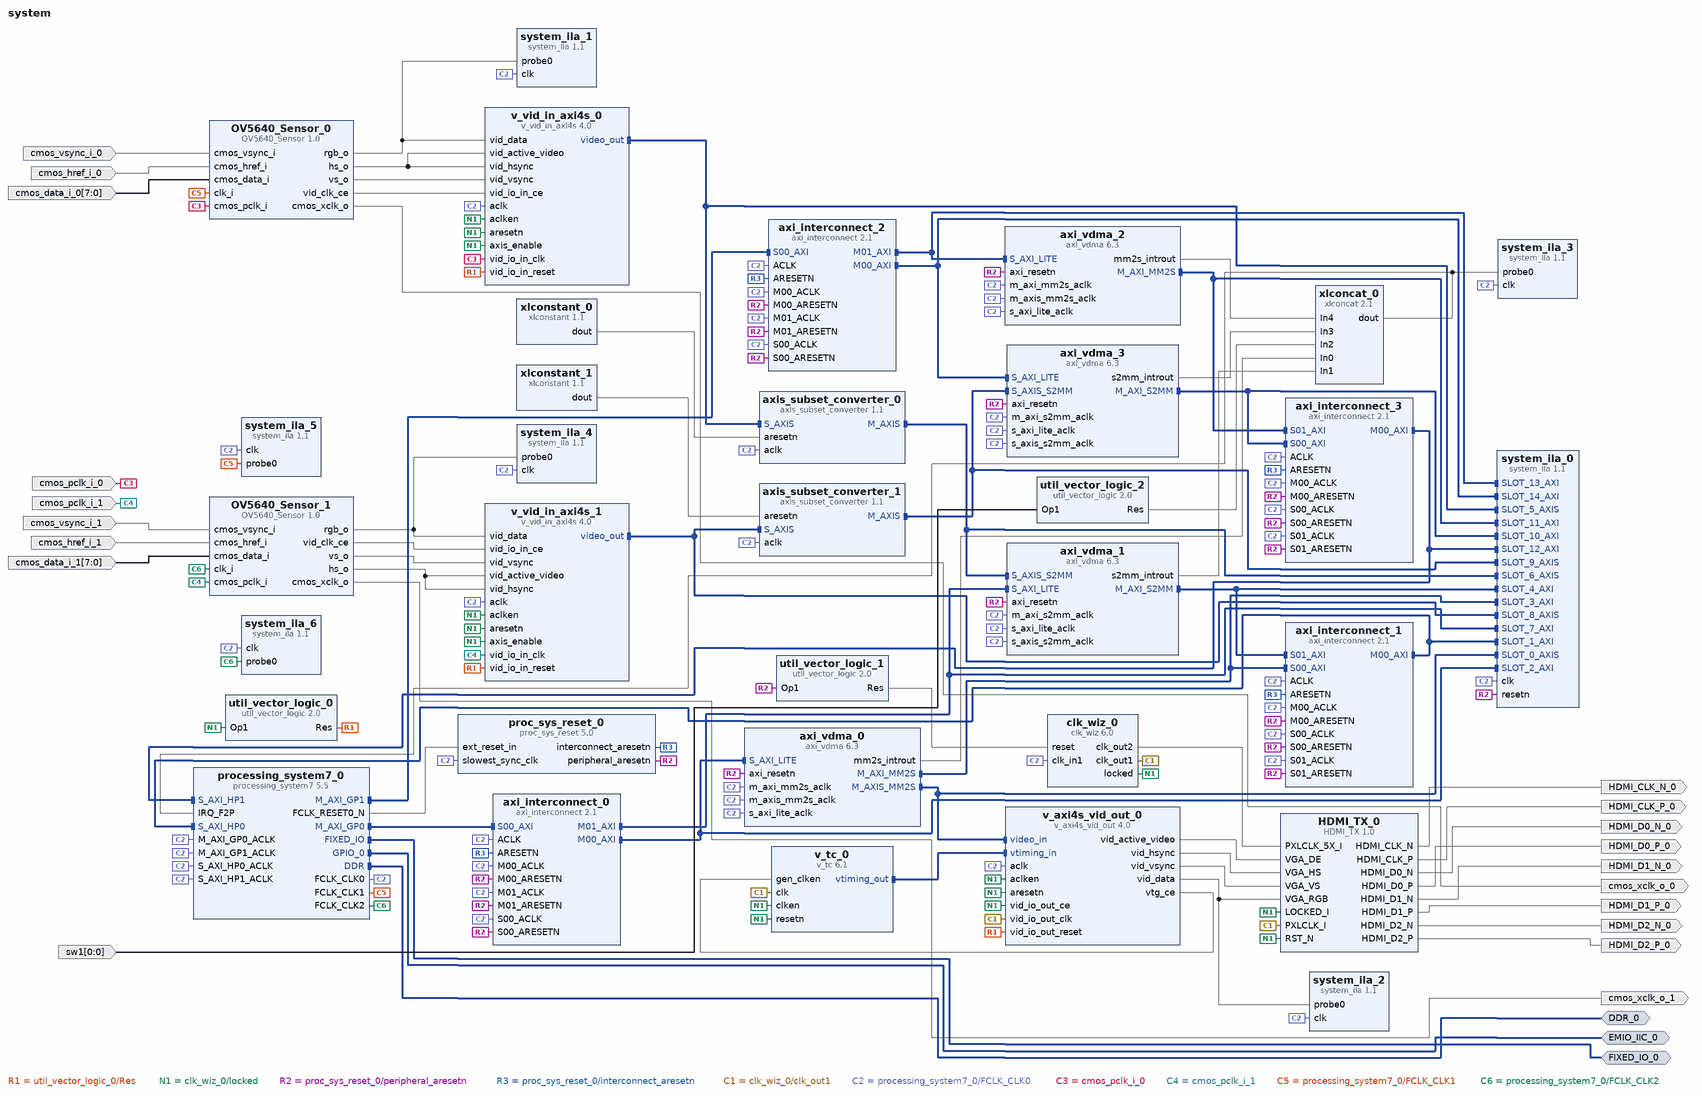
[diagram p0: block diagram of the top level]
# Vivado block design system, xc7z020clg400-2, Vivado 2018.3
create_bd_design system

create_bd_intf_port -mode Master -vlnv xilinx.com:interface:ddrx_rtl:1.0 DDR_0
create_bd_intf_port -mode Master -vlnv xilinx.com:display_processing_system7:fixedio_rtl:1.0 FIXED_IO_0
create_bd_intf_port -mode Master -vlnv xilinx.com:interface:gpio_rtl:1.0 EMIO_IIC_0
create_bd_port -dir O -type clk HDMI_CLK_P_0
create_bd_port -dir O -type clk HDMI_CLK_N_0
create_bd_port -dir O HDMI_D2_P_0
create_bd_port -dir O HDMI_D2_N_0
create_bd_port -dir O HDMI_D1_P_0
create_bd_port -dir O HDMI_D1_N_0
create_bd_port -dir O HDMI_D0_P_0
create_bd_port -dir O HDMI_D0_N_0
create_bd_port -dir I cmos_vsync_i_0
create_bd_port -dir I cmos_href_i_0
create_bd_port -dir I -from 7 -to 0 cmos_data_i_0
create_bd_port -dir O cmos_xclk_o_0
create_bd_port -dir I cmos_pclk_i_0
create_bd_port -dir I -from 0 -to 0 sw1
create_bd_port -dir I cmos_pclk_i_1
create_bd_port -dir I cmos_vsync_i_1
create_bd_port -dir I cmos_href_i_1
create_bd_port -dir I -from 7 -to 0 cmos_data_i_1
create_bd_port -dir O cmos_xclk_o_1

create_bd_cell -type ip -vlnv xilinx.com:user:HDMI_TX:1.0 HDMI_TX_0
create_bd_cell -type ip -vlnv xilinx.com:user:OV5640_Sensor:1.0 OV5640_Sensor_0
create_bd_cell -type ip -vlnv xilinx.com:ip:processing_system7:5.5 processing_system7_0
set_property -dict [list \
  CONFIG.PCW_CRYSTAL_PERIPHERAL_FREQMHZ 50 \
  CONFIG.PCW_ENET0_PERIPHERAL_ENABLE 0 \
  CONFIG.PCW_EN_CLK1_PORT 1 \
  CONFIG.PCW_EN_CLK2_PORT 1 \
  CONFIG.PCW_FCLK_CLK1_BUF TRUE \
  CONFIG.PCW_FCLK_CLK2_BUF TRUE \
  CONFIG.PCW_FPGA0_PERIPHERAL_FREQMHZ 100 \
  CONFIG.PCW_FPGA1_PERIPHERAL_FREQMHZ 25 \
  CONFIG.PCW_FPGA2_PERIPHERAL_FREQMHZ 25 \
  CONFIG.PCW_FPGA_FCLK1_ENABLE 1 \
  CONFIG.PCW_FPGA_FCLK2_ENABLE 1 \
  CONFIG.PCW_GPIO_EMIO_GPIO_ENABLE 1 \
  CONFIG.PCW_GPIO_EMIO_GPIO_IO 4 \
  CONFIG.PCW_GPIO_EMIO_GPIO_WIDTH 4 \
  CONFIG.PCW_GPIO_MIO_GPIO_ENABLE 1 \
  CONFIG.PCW_GPIO_MIO_GPIO_IO MIO \
  CONFIG.PCW_I2C_RESET_ENABLE 1 \
  CONFIG.PCW_IRQ_F2P_INTR 1 \
  CONFIG.PCW_P2F_GPIO_INTR 1 \
  CONFIG.PCW_PRESET_BANK1_VOLTAGE {LVCMOS 1.8V} \
  CONFIG.PCW_QSPI_GRP_FBCLK_ENABLE 1 \
  CONFIG.PCW_QSPI_GRP_FBCLK_IO {MIO 8} \
  CONFIG.PCW_QSPI_GRP_SINGLE_SS_ENABLE 1 \
  CONFIG.PCW_QSPI_GRP_SINGLE_SS_IO {MIO 1 .. 6} \
  CONFIG.PCW_QSPI_PERIPHERAL_ENABLE 1 \
  CONFIG.PCW_QSPI_QSPI_IO {MIO 1 .. 6} \
  CONFIG.PCW_SD0_GRP_CD_ENABLE 1 \
  CONFIG.PCW_SD0_GRP_CD_IO {MIO 47} \
  CONFIG.PCW_SD0_GRP_WP_ENABLE 0 \
  CONFIG.PCW_SD0_PERIPHERAL_ENABLE 1 \
  CONFIG.PCW_SD0_SD0_IO {MIO 40 .. 45} \
  CONFIG.PCW_SDIO_PERIPHERAL_FREQMHZ 100 \
  CONFIG.PCW_SINGLE_QSPI_DATA_MODE x4 \
  CONFIG.PCW_UART1_PERIPHERAL_ENABLE 1 \
  CONFIG.PCW_UART1_UART1_IO {MIO 48 .. 49} \
  CONFIG.PCW_UART_PERIPHERAL_FREQMHZ 100 \
  CONFIG.PCW_UIPARAM_DDR_PARTNO {MT41K256M16 RE-125} \
  CONFIG.PCW_USB0_PERIPHERAL_ENABLE 0 \
  CONFIG.PCW_USB_RESET_ENABLE 1 \
  CONFIG.PCW_USE_FABRIC_INTERRUPT 1 \
  CONFIG.PCW_USE_M_AXI_GP1 1 \
  CONFIG.PCW_USE_S_AXI_HP0 1 \
  CONFIG.PCW_USE_S_AXI_HP1 1 \
] [get_bd_cells processing_system7_0]
# 216 more settings of processing_system7_0 are not shown: defaults, MIO pin electricals, DDR timing, and values the tool derives
create_bd_cell -type ip -vlnv xilinx.com:ip:v_vid_in_axi4s:4.0 v_vid_in_axi4s_0
set_property -dict {CONFIG.C_HAS_ASYNC_CLK 1} [get_bd_cells v_vid_in_axi4s_0]
create_bd_cell -type ip -vlnv xilinx.com:ip:v_axi4s_vid_out:4.0 v_axi4s_vid_out_0
set_property -dict {CONFIG.C_HAS_ASYNC_CLK 1} [get_bd_cells v_axi4s_vid_out_0]
create_bd_cell -type ip -vlnv xilinx.com:ip:clk_wiz:6.0 clk_wiz_0
set_property -dict [list \
  CONFIG.CLKOUT1_JITTER 337.616 \
  CONFIG.CLKOUT1_PHASE_ERROR 322.999 \
  CONFIG.CLKOUT1_REQUESTED_OUT_FREQ 74.25 \
  CONFIG.CLKOUT2_JITTER 258.703 \
  CONFIG.CLKOUT2_PHASE_ERROR 322.999 \
  CONFIG.CLKOUT2_REQUESTED_OUT_FREQ 371.25 \
  CONFIG.CLKOUT2_USED true \
  CONFIG.MMCM_CLKFBOUT_MULT_F 37.125 \
  CONFIG.MMCM_CLKOUT0_DIVIDE_F 10.000 \
  CONFIG.MMCM_CLKOUT1_DIVIDE 2 \
  CONFIG.MMCM_DIVCLK_DIVIDE 5 \
  CONFIG.NUM_OUT_CLKS 2 \
] [get_bd_cells clk_wiz_0]
create_bd_cell -type ip -vlnv xilinx.com:ip:util_vector_logic:2.0 util_vector_logic_0
set_property -dict {CONFIG.C_OPERATION not CONFIG.C_SIZE 1} [get_bd_cells util_vector_logic_0]
create_bd_cell -type ip -vlnv xilinx.com:ip:axi_vdma:6.3 axi_vdma_0
set_property -dict [list \
  CONFIG.c_include_mm2s_dre 1 \
  CONFIG.c_include_s2mm 0 \
  CONFIG.c_m_axis_mm2s_tdata_width 24 \
  CONFIG.c_mm2s_genlock_mode 0 \
  CONFIG.c_mm2s_max_burst_length 128 \
] [get_bd_cells axi_vdma_0]
create_bd_cell -type ip -vlnv xilinx.com:ip:xlconstant:1.1 xlconstant_0
set_property -dict {CONFIG.CONST_VAL 1 CONFIG.CONST_WIDTH 1} [get_bd_cells xlconstant_0]
create_bd_cell -type ip -vlnv xilinx.com:ip:axi_interconnect:2.1 axi_interconnect_0
set_property -dict {CONFIG.NUM_MI 2} [get_bd_cells axi_interconnect_0]
create_bd_cell -type ip -vlnv xilinx.com:ip:proc_sys_reset:5.0 proc_sys_reset_0
create_bd_cell -type ip -vlnv xilinx.com:ip:axi_interconnect:2.1 axi_interconnect_1
set_property -dict {CONFIG.NUM_MI 1 CONFIG.NUM_SI 2} [get_bd_cells axi_interconnect_1]
create_bd_cell -type ip -vlnv xilinx.com:ip:v_tc:6.1 v_tc_0
set_property -dict {CONFIG.HAS_AXI4_LITE false CONFIG.enable_detection false} [get_bd_cells v_tc_0]
create_bd_cell -type ip -vlnv xilinx.com:ip:util_vector_logic:2.0 util_vector_logic_1
set_property -dict {CONFIG.C_OPERATION not CONFIG.C_SIZE 1} [get_bd_cells util_vector_logic_1]
create_bd_cell -type ip -vlnv xilinx.com:ip:axis_subset_converter:1.1 axis_subset_converter_0
create_bd_cell -type ip -vlnv xilinx.com:ip:axi_vdma:6.3 axi_vdma_1
set_property -dict [list \
  CONFIG.c_include_mm2s 0 \
  CONFIG.c_include_s2mm_dre 1 \
  CONFIG.c_s2mm_genlock_mode 0 \
  CONFIG.c_s2mm_linebuffer_depth 4096 \
  CONFIG.c_s2mm_max_burst_length 128 \
] [get_bd_cells axi_vdma_1]
create_bd_cell -type ip -vlnv xilinx.com:ip:xlconcat:2.1 xlconcat_0
set_property -dict {CONFIG.NUM_PORTS 5} [get_bd_cells xlconcat_0]
create_bd_cell -type ip -vlnv xilinx.com:ip:system_ila:1.1 system_ila_0
set_property -dict [list \
  CONFIG.C_DATA_DEPTH 1024 \
  CONFIG.C_MON_TYPE INTERFACE \
  CONFIG.C_NUM_MONITOR_SLOTS 15 \
  CONFIG.C_SLOT_0_APC_EN 0 \
  CONFIG.C_SLOT_0_AXI_DATA_SEL 1 \
  CONFIG.C_SLOT_0_AXI_TRIG_SEL 1 \
  CONFIG.C_SLOT_0_INTF_TYPE xilinx.com:interface:axis_rtl:1.0 \
  CONFIG.C_SLOT_10_APC_EN 0 \
  CONFIG.C_SLOT_10_AXI_AR_SEL_DATA 1 \
  CONFIG.C_SLOT_10_AXI_AR_SEL_TRIG 1 \
  CONFIG.C_SLOT_10_AXI_AW_SEL_DATA 1 \
  CONFIG.C_SLOT_10_AXI_AW_SEL_TRIG 1 \
  CONFIG.C_SLOT_10_AXI_B_SEL_DATA 1 \
  CONFIG.C_SLOT_10_AXI_B_SEL_TRIG 1 \
  CONFIG.C_SLOT_10_AXI_R_SEL_DATA 1 \
  CONFIG.C_SLOT_10_AXI_R_SEL_TRIG 1 \
  CONFIG.C_SLOT_10_AXI_W_SEL_DATA 1 \
  CONFIG.C_SLOT_10_AXI_W_SEL_TRIG 1 \
  CONFIG.C_SLOT_10_INTF_TYPE xilinx.com:interface:aximm_rtl:1.0 \
  CONFIG.C_SLOT_11_APC_EN 0 \
  CONFIG.C_SLOT_11_AXI_AR_SEL_DATA 1 \
  CONFIG.C_SLOT_11_AXI_AR_SEL_TRIG 1 \
  CONFIG.C_SLOT_11_AXI_AW_SEL_DATA 1 \
  CONFIG.C_SLOT_11_AXI_AW_SEL_TRIG 1 \
  CONFIG.C_SLOT_11_AXI_B_SEL_DATA 1 \
  CONFIG.C_SLOT_11_AXI_B_SEL_TRIG 1 \
  CONFIG.C_SLOT_11_AXI_R_SEL_DATA 1 \
  CONFIG.C_SLOT_11_AXI_R_SEL_TRIG 1 \
  CONFIG.C_SLOT_11_AXI_W_SEL_DATA 1 \
  CONFIG.C_SLOT_11_AXI_W_SEL_TRIG 1 \
  CONFIG.C_SLOT_11_INTF_TYPE xilinx.com:interface:aximm_rtl:1.0 \
  CONFIG.C_SLOT_12_APC_EN 0 \
  CONFIG.C_SLOT_12_AXI_AR_SEL_DATA 1 \
  CONFIG.C_SLOT_12_AXI_AR_SEL_TRIG 1 \
  CONFIG.C_SLOT_12_AXI_AW_SEL_DATA 1 \
  CONFIG.C_SLOT_12_AXI_AW_SEL_TRIG 1 \
  CONFIG.C_SLOT_12_AXI_B_SEL_DATA 1 \
  CONFIG.C_SLOT_12_AXI_B_SEL_TRIG 1 \
  CONFIG.C_SLOT_12_AXI_R_SEL_DATA 1 \
  CONFIG.C_SLOT_12_AXI_R_SEL_TRIG 1 \
  CONFIG.C_SLOT_12_AXI_W_SEL_DATA 1 \
  CONFIG.C_SLOT_12_AXI_W_SEL_TRIG 1 \
  CONFIG.C_SLOT_12_INTF_TYPE xilinx.com:interface:aximm_rtl:1.0 \
  CONFIG.C_SLOT_13_APC_EN 0 \
  CONFIG.C_SLOT_13_AXI_AR_SEL_DATA 1 \
  CONFIG.C_SLOT_13_AXI_AR_SEL_TRIG 1 \
  CONFIG.C_SLOT_13_AXI_AW_SEL_DATA 1 \
  CONFIG.C_SLOT_13_AXI_AW_SEL_TRIG 1 \
  CONFIG.C_SLOT_13_AXI_B_SEL_DATA 1 \
  CONFIG.C_SLOT_13_AXI_B_SEL_TRIG 1 \
  CONFIG.C_SLOT_13_AXI_R_SEL_DATA 1 \
  CONFIG.C_SLOT_13_AXI_R_SEL_TRIG 1 \
  CONFIG.C_SLOT_13_AXI_W_SEL_DATA 1 \
  CONFIG.C_SLOT_13_AXI_W_SEL_TRIG 1 \
  CONFIG.C_SLOT_13_INTF_TYPE xilinx.com:interface:aximm_rtl:1.0 \
  CONFIG.C_SLOT_14_APC_EN 0 \
  CONFIG.C_SLOT_14_AXI_AR_SEL_DATA 1 \
  CONFIG.C_SLOT_14_AXI_AR_SEL_TRIG 1 \
  CONFIG.C_SLOT_14_AXI_AW_SEL_DATA 1 \
  CONFIG.C_SLOT_14_AXI_AW_SEL_TRIG 1 \
  CONFIG.C_SLOT_14_AXI_B_SEL_DATA 1 \
  CONFIG.C_SLOT_14_AXI_B_SEL_TRIG 1 \
  CONFIG.C_SLOT_14_AXI_R_SEL_DATA 1 \
  CONFIG.C_SLOT_14_AXI_R_SEL_TRIG 1 \
  CONFIG.C_SLOT_14_AXI_W_SEL_DATA 1 \
  CONFIG.C_SLOT_14_AXI_W_SEL_TRIG 1 \
  CONFIG.C_SLOT_14_INTF_TYPE xilinx.com:interface:aximm_rtl:1.0 \
  CONFIG.C_SLOT_1_APC_EN 0 \
  CONFIG.C_SLOT_1_AXI_AR_SEL_DATA 1 \
  CONFIG.C_SLOT_1_AXI_AR_SEL_TRIG 1 \
  CONFIG.C_SLOT_1_AXI_AW_SEL_DATA 1 \
  CONFIG.C_SLOT_1_AXI_AW_SEL_TRIG 1 \
  CONFIG.C_SLOT_1_AXI_B_SEL_DATA 1 \
  CONFIG.C_SLOT_1_AXI_B_SEL_TRIG 1 \
  CONFIG.C_SLOT_1_AXI_R_SEL_DATA 1 \
  CONFIG.C_SLOT_1_AXI_R_SEL_TRIG 1 \
  CONFIG.C_SLOT_1_AXI_W_SEL_DATA 1 \
  CONFIG.C_SLOT_1_AXI_W_SEL_TRIG 1 \
  CONFIG.C_SLOT_1_INTF_TYPE xilinx.com:interface:aximm_rtl:1.0 \
  CONFIG.C_SLOT_2_APC_EN 0 \
  CONFIG.C_SLOT_2_AXI_AR_SEL_DATA 1 \
  CONFIG.C_SLOT_2_AXI_AR_SEL_TRIG 1 \
  CONFIG.C_SLOT_2_AXI_AW_SEL_DATA 1 \
  CONFIG.C_SLOT_2_AXI_AW_SEL_TRIG 1 \
  CONFIG.C_SLOT_2_AXI_B_SEL_DATA 1 \
  CONFIG.C_SLOT_2_AXI_B_SEL_TRIG 1 \
  CONFIG.C_SLOT_2_AXI_R_SEL_DATA 1 \
  CONFIG.C_SLOT_2_AXI_R_SEL_TRIG 1 \
  CONFIG.C_SLOT_2_AXI_W_SEL_DATA 1 \
  CONFIG.C_SLOT_2_AXI_W_SEL_TRIG 1 \
  CONFIG.C_SLOT_2_INTF_TYPE xilinx.com:interface:aximm_rtl:1.0 \
  CONFIG.C_SLOT_3_APC_EN 0 \
  CONFIG.C_SLOT_3_AXI_AR_SEL_DATA 1 \
  CONFIG.C_SLOT_3_AXI_AR_SEL_TRIG 1 \
  CONFIG.C_SLOT_3_AXI_AW_SEL_DATA 1 \
  CONFIG.C_SLOT_3_AXI_AW_SEL_TRIG 1 \
  CONFIG.C_SLOT_3_AXI_B_SEL_DATA 1 \
  CONFIG.C_SLOT_3_AXI_B_SEL_TRIG 1 \
  CONFIG.C_SLOT_3_AXI_R_SEL_DATA 1 \
  CONFIG.C_SLOT_3_AXI_R_SEL_TRIG 1 \
  CONFIG.C_SLOT_3_AXI_W_SEL_DATA 1 \
  CONFIG.C_SLOT_3_AXI_W_SEL_TRIG 1 \
  CONFIG.C_SLOT_3_INTF_TYPE xilinx.com:interface:aximm_rtl:1.0 \
  CONFIG.C_SLOT_4_APC_EN 0 \
  CONFIG.C_SLOT_4_AXI_AR_SEL_DATA 1 \
  CONFIG.C_SLOT_4_AXI_AR_SEL_TRIG 1 \
  CONFIG.C_SLOT_4_AXI_AW_SEL_DATA 1 \
  CONFIG.C_SLOT_4_AXI_AW_SEL_TRIG 1 \
  CONFIG.C_SLOT_4_AXI_B_SEL_DATA 1 \
  CONFIG.C_SLOT_4_AXI_B_SEL_TRIG 1 \
  CONFIG.C_SLOT_4_AXI_R_SEL_DATA 1 \
  CONFIG.C_SLOT_4_AXI_R_SEL_TRIG 1 \
  CONFIG.C_SLOT_4_AXI_W_SEL_DATA 1 \
  CONFIG.C_SLOT_4_AXI_W_SEL_TRIG 1 \
  CONFIG.C_SLOT_4_INTF_TYPE xilinx.com:interface:aximm_rtl:1.0 \
  CONFIG.C_SLOT_5_APC_EN 0 \
  CONFIG.C_SLOT_5_AXI_DATA_SEL 1 \
  CONFIG.C_SLOT_5_AXI_TRIG_SEL 1 \
  CONFIG.C_SLOT_5_INTF_TYPE xilinx.com:interface:axis_rtl:1.0 \
  CONFIG.C_SLOT_6_APC_EN 0 \
  CONFIG.C_SLOT_6_AXI_DATA_SEL 1 \
  CONFIG.C_SLOT_6_AXI_TRIG_SEL 1 \
  CONFIG.C_SLOT_6_INTF_TYPE xilinx.com:interface:axis_rtl:1.0 \
  CONFIG.C_SLOT_7_APC_EN 0 \
  CONFIG.C_SLOT_7_AXI_AR_SEL_DATA 1 \
  CONFIG.C_SLOT_7_AXI_AR_SEL_TRIG 1 \
  CONFIG.C_SLOT_7_AXI_AW_SEL_DATA 1 \
  CONFIG.C_SLOT_7_AXI_AW_SEL_TRIG 1 \
  CONFIG.C_SLOT_7_AXI_B_SEL_DATA 1 \
  CONFIG.C_SLOT_7_AXI_B_SEL_TRIG 1 \
  CONFIG.C_SLOT_7_AXI_R_SEL_DATA 1 \
  CONFIG.C_SLOT_7_AXI_R_SEL_TRIG 1 \
  CONFIG.C_SLOT_7_AXI_W_SEL_DATA 1 \
  CONFIG.C_SLOT_7_AXI_W_SEL_TRIG 1 \
  CONFIG.C_SLOT_7_INTF_TYPE xilinx.com:interface:aximm_rtl:1.0 \
  CONFIG.C_SLOT_8_APC_EN 0 \
  CONFIG.C_SLOT_8_AXI_DATA_SEL 1 \
  CONFIG.C_SLOT_8_AXI_TRIG_SEL 1 \
  CONFIG.C_SLOT_8_INTF_TYPE xilinx.com:interface:axis_rtl:1.0 \
  CONFIG.C_SLOT_9_APC_EN 0 \
  CONFIG.C_SLOT_9_AXI_DATA_SEL 1 \
  CONFIG.C_SLOT_9_AXI_TRIG_SEL 1 \
  CONFIG.C_SLOT_9_INTF_TYPE xilinx.com:interface:axis_rtl:1.0 \
] [get_bd_cells system_ila_0]
create_bd_cell -type ip -vlnv xilinx.com:ip:system_ila:1.1 system_ila_1
set_property -dict {CONFIG.C_MON_TYPE NATIVE CONFIG.C_NUM_OF_PROBES 1 CONFIG.C_PROBE0_TYPE 0} [get_bd_cells system_ila_1]
create_bd_cell -type ip -vlnv xilinx.com:ip:system_ila:1.1 system_ila_2
set_property -dict {CONFIG.C_MON_TYPE NATIVE CONFIG.C_NUM_OF_PROBES 1 CONFIG.C_PROBE0_TYPE 0} [get_bd_cells system_ila_2]
create_bd_cell -type ip -vlnv xilinx.com:ip:system_ila:1.1 system_ila_3
set_property -dict {CONFIG.C_MON_TYPE NATIVE CONFIG.C_NUM_OF_PROBES 1 CONFIG.C_PROBE0_TYPE 0} [get_bd_cells system_ila_3]
create_bd_cell -type ip -vlnv xilinx.com:ip:util_vector_logic:2.0 util_vector_logic_2
set_property -dict {CONFIG.C_OPERATION not CONFIG.C_SIZE 1} [get_bd_cells util_vector_logic_2]
create_bd_cell -type ip -vlnv xilinx.com:user:OV5640_Sensor:1.0 OV5640_Sensor_1
create_bd_cell -type ip -vlnv xilinx.com:ip:v_vid_in_axi4s:4.0 v_vid_in_axi4s_1
set_property -dict {CONFIG.C_HAS_ASYNC_CLK 1} [get_bd_cells v_vid_in_axi4s_1]
create_bd_cell -type ip -vlnv xilinx.com:ip:axis_subset_converter:1.1 axis_subset_converter_1
create_bd_cell -type ip -vlnv xilinx.com:ip:xlconstant:1.1 xlconstant_1
create_bd_cell -type ip -vlnv xilinx.com:ip:axi_vdma:6.3 axi_vdma_2
set_property -dict [list \
  CONFIG.c_include_s2mm 0 \
  CONFIG.c_m_axis_mm2s_tdata_width 24 \
  CONFIG.c_mm2s_genlock_mode 0 \
  CONFIG.c_mm2s_max_burst_length 128 \
] [get_bd_cells axi_vdma_2]
create_bd_cell -type ip -vlnv xilinx.com:ip:axi_vdma:6.3 axi_vdma_3
set_property -dict [list \
  CONFIG.c_enable_vert_flip 0 \
  CONFIG.c_include_mm2s 0 \
  CONFIG.c_include_s2mm_dre 1 \
  CONFIG.c_s2mm_genlock_mode 0 \
  CONFIG.c_s2mm_max_burst_length 128 \
] [get_bd_cells axi_vdma_3]
create_bd_cell -type ip -vlnv xilinx.com:ip:axi_interconnect:2.1 axi_interconnect_2
create_bd_cell -type ip -vlnv xilinx.com:ip:axi_interconnect:2.1 axi_interconnect_3
set_property -dict {CONFIG.NUM_MI 1 CONFIG.NUM_SI 2} [get_bd_cells axi_interconnect_3]
create_bd_cell -type ip -vlnv xilinx.com:ip:system_ila:1.1 system_ila_4
set_property -dict {CONFIG.C_MON_TYPE NATIVE CONFIG.C_NUM_OF_PROBES 1 CONFIG.C_PROBE0_TYPE 0} [get_bd_cells system_ila_4]
create_bd_cell -type ip -vlnv xilinx.com:ip:system_ila:1.1 system_ila_5
set_property -dict {CONFIG.C_MON_TYPE NATIVE CONFIG.C_NUM_OF_PROBES 1 CONFIG.C_PROBE0_TYPE 0} [get_bd_cells system_ila_5]
create_bd_cell -type ip -vlnv xilinx.com:ip:system_ila:1.1 system_ila_6
set_property -dict {CONFIG.C_MON_TYPE NATIVE CONFIG.C_NUM_OF_PROBES 1 CONFIG.C_PROBE0_TYPE 0} [get_bd_cells system_ila_6]

# ---- connections ----

connect_bd_intf_net -intf_net v_vid_in_axi4s_1_video_out [get_bd_intf_pins v_vid_in_axi4s_1/video_out] [get_bd_intf_pins axis_subset_converter_1/S_AXIS]
connect_bd_intf_net [get_bd_intf_pins v_vid_in_axi4s_1/video_out] [get_bd_intf_pins system_ila_0/SLOT_8_AXIS]
connect_bd_intf_net -intf_net axi_vdma_3_M_AXI_S2MM [get_bd_intf_pins axi_vdma_3/M_AXI_S2MM] [get_bd_intf_pins axi_interconnect_3/S00_AXI]
connect_bd_intf_net [get_bd_intf_pins axi_vdma_3/M_AXI_S2MM] [get_bd_intf_pins system_ila_0/SLOT_10_AXI]
connect_bd_intf_net -intf_net axi_interconnect_2_M00_AXI [get_bd_intf_pins axi_interconnect_2/M00_AXI] [get_bd_intf_pins axi_vdma_3/S_AXI_LITE]
connect_bd_intf_net [get_bd_intf_pins axi_interconnect_2/M00_AXI] [get_bd_intf_pins system_ila_0/SLOT_14_AXI]
connect_bd_intf_net -intf_net v_vid_in_axi4s_0_video_out [get_bd_intf_pins v_vid_in_axi4s_0/video_out] [get_bd_intf_pins axis_subset_converter_0/S_AXIS]
connect_bd_intf_net [get_bd_intf_pins v_vid_in_axi4s_0/video_out] [get_bd_intf_pins system_ila_0/SLOT_5_AXIS]
connect_bd_intf_net -intf_net axi_vdma_2_M_AXI_MM2S [get_bd_intf_pins axi_vdma_2/M_AXI_MM2S] [get_bd_intf_pins axi_interconnect_3/S01_AXI]
connect_bd_intf_net [get_bd_intf_pins axi_vdma_2/M_AXI_MM2S] [get_bd_intf_pins system_ila_0/SLOT_11_AXI]
connect_bd_intf_net [get_bd_intf_pins processing_system7_0/M_AXI_GP1] [get_bd_intf_pins axi_interconnect_2/S00_AXI]
connect_bd_intf_net -intf_net axi_vdma_1_M_AXI_S2MM [get_bd_intf_pins axi_vdma_1/M_AXI_S2MM] [get_bd_intf_pins axi_interconnect_1/S01_AXI]
connect_bd_intf_net [get_bd_intf_pins axi_vdma_1/M_AXI_S2MM] [get_bd_intf_pins system_ila_0/SLOT_4_AXI]
connect_bd_intf_net -intf_net axi_vdma_0_M_AXI_MM2S [get_bd_intf_pins axi_vdma_0/M_AXI_MM2S] [get_bd_intf_pins axi_interconnect_1/S00_AXI]
connect_bd_intf_net [get_bd_intf_pins axi_vdma_0/M_AXI_MM2S] [get_bd_intf_pins system_ila_0/SLOT_3_AXI]
connect_bd_intf_net [get_bd_intf_pins v_tc_0/vtiming_out] [get_bd_intf_pins v_axi4s_vid_out_0/vtiming_in]
connect_bd_intf_net -intf_net axis_subset_converter_1_M_AXIS [get_bd_intf_pins axis_subset_converter_1/M_AXIS] [get_bd_intf_pins axi_vdma_3/S_AXIS_S2MM]
connect_bd_intf_net [get_bd_intf_pins axis_subset_converter_1/M_AXIS] [get_bd_intf_pins system_ila_0/SLOT_9_AXIS]
connect_bd_intf_net -intf_net axi_interconnect_2_M01_AXI [get_bd_intf_pins axi_interconnect_2/M01_AXI] [get_bd_intf_pins axi_vdma_2/S_AXI_LITE]
connect_bd_intf_net [get_bd_intf_pins axi_interconnect_2/M01_AXI] [get_bd_intf_pins system_ila_0/SLOT_13_AXI]
connect_bd_intf_net -intf_net axi_interconnect_3_M00_AXI [get_bd_intf_pins axi_interconnect_3/M00_AXI] [get_bd_intf_pins processing_system7_0/S_AXI_HP1]
connect_bd_intf_net [get_bd_intf_pins axi_interconnect_3/M00_AXI] [get_bd_intf_pins system_ila_0/SLOT_12_AXI]
connect_bd_intf_net -intf_net axi_interconnect_0_M00_AXI [get_bd_intf_pins axi_interconnect_0/M00_AXI] [get_bd_intf_pins axi_vdma_0/S_AXI_LITE]
connect_bd_intf_net [get_bd_intf_pins axi_interconnect_0/M00_AXI] [get_bd_intf_pins system_ila_0/SLOT_2_AXI]
connect_bd_intf_net [get_bd_intf_pins axi_interconnect_0/S00_AXI] [get_bd_intf_pins processing_system7_0/M_AXI_GP0]
connect_bd_intf_net -intf_net axis_subset_converter_0_M_AXIS [get_bd_intf_pins axis_subset_converter_0/M_AXIS] [get_bd_intf_pins axi_vdma_1/S_AXIS_S2MM]
connect_bd_intf_net [get_bd_intf_pins axis_subset_converter_0/M_AXIS] [get_bd_intf_pins system_ila_0/SLOT_6_AXIS]
connect_bd_intf_net -intf_net axi_interconnect_0_M01_AXI [get_bd_intf_pins axi_interconnect_0/M01_AXI] [get_bd_intf_pins axi_vdma_1/S_AXI_LITE]
connect_bd_intf_net [get_bd_intf_pins axi_interconnect_0/M01_AXI] [get_bd_intf_pins system_ila_0/SLOT_7_AXI]
connect_bd_intf_net [get_bd_intf_ports FIXED_IO_0] [get_bd_intf_pins processing_system7_0/FIXED_IO]
connect_bd_intf_net -intf_net axi_vdma_0_M_AXIS_MM2S [get_bd_intf_pins axi_vdma_0/M_AXIS_MM2S] [get_bd_intf_pins v_axi4s_vid_out_0/video_in]
connect_bd_intf_net [get_bd_intf_pins axi_vdma_0/M_AXIS_MM2S] [get_bd_intf_pins system_ila_0/SLOT_0_AXIS]
connect_bd_intf_net [get_bd_intf_ports EMIO_IIC_0] [get_bd_intf_pins processing_system7_0/GPIO_0]
connect_bd_intf_net -intf_net axi_interconnect_1_M00_AXI [get_bd_intf_pins axi_interconnect_1/M00_AXI] [get_bd_intf_pins processing_system7_0/S_AXI_HP0]
connect_bd_intf_net [get_bd_intf_pins axi_interconnect_1/M00_AXI] [get_bd_intf_pins system_ila_0/SLOT_1_AXI]
connect_bd_intf_net [get_bd_intf_ports DDR_0] [get_bd_intf_pins processing_system7_0/DDR]
connect_bd_net [get_bd_pins OV5640_Sensor_0/hs_o] [get_bd_pins v_vid_in_axi4s_0/vid_active_video] [get_bd_pins v_vid_in_axi4s_0/vid_hsync]
connect_bd_net [get_bd_pins OV5640_Sensor_0/vs_o] [get_bd_pins v_vid_in_axi4s_0/vid_vsync]
connect_bd_net -net OV5640_Sensor_0_rgb_o [get_bd_pins OV5640_Sensor_0/rgb_o] \
  [get_bd_pins v_vid_in_axi4s_0/vid_data] [get_bd_pins system_ila_1/probe0]
connect_bd_net [get_bd_pins OV5640_Sensor_0/vid_clk_ce] [get_bd_pins v_vid_in_axi4s_0/vid_io_in_ce]
connect_bd_net [get_bd_pins util_vector_logic_0/Res] \
  [get_bd_pins v_vid_in_axi4s_0/vid_io_in_reset] [get_bd_pins v_axi4s_vid_out_0/vid_io_out_reset] \
  [get_bd_pins v_vid_in_axi4s_1/vid_io_in_reset]
connect_bd_net [get_bd_pins clk_wiz_0/locked] \
  [get_bd_pins v_vid_in_axi4s_0/aresetn] [get_bd_pins v_vid_in_axi4s_0/aclken] [get_bd_pins v_vid_in_axi4s_0/axis_enable] \
  [get_bd_pins util_vector_logic_0/Op1] [get_bd_pins v_tc_0/clken] [get_bd_pins v_tc_0/resetn] \
  [get_bd_pins v_axi4s_vid_out_0/aclken] [get_bd_pins v_axi4s_vid_out_0/aresetn] \
  [get_bd_pins v_axi4s_vid_out_0/vid_io_out_ce] [get_bd_pins HDMI_TX_0/RST_N] [get_bd_pins HDMI_TX_0/LOCKED_I] \
  [get_bd_pins v_vid_in_axi4s_1/aclken] [get_bd_pins v_vid_in_axi4s_1/aresetn] [get_bd_pins v_vid_in_axi4s_1/axis_enable]
connect_bd_net -net S00_ARESETN_1 [get_bd_pins proc_sys_reset_0/peripheral_aresetn] \
  [get_bd_pins axi_interconnect_0/S00_ARESETN] [get_bd_pins axi_interconnect_0/M00_ARESETN] \
  [get_bd_pins axi_vdma_0/axi_resetn] [get_bd_pins axi_interconnect_1/S00_ARESETN] \
  [get_bd_pins axi_interconnect_1/M00_ARESETN] [get_bd_pins axi_interconnect_1/S01_ARESETN] \
  [get_bd_pins util_vector_logic_1/Op1] [get_bd_pins axi_vdma_1/axi_resetn] [get_bd_pins axi_interconnect_0/M01_ARESETN] \
  [get_bd_pins system_ila_0/resetn] [get_bd_pins axi_interconnect_2/M01_ARESETN] [get_bd_pins axi_interconnect_2/M00_ARESETN] \
  [get_bd_pins axi_interconnect_2/S00_ARESETN] [get_bd_pins axi_interconnect_3/S01_ARESETN] \
  [get_bd_pins axi_interconnect_3/M00_ARESETN] [get_bd_pins axi_interconnect_3/S00_ARESETN] \
  [get_bd_pins axi_vdma_2/axi_resetn] [get_bd_pins axi_vdma_3/axi_resetn]
connect_bd_net -net ARESETN_1 [get_bd_pins proc_sys_reset_0/interconnect_aresetn] \
  [get_bd_pins axi_interconnect_1/ARESETN] [get_bd_pins axi_interconnect_0/ARESETN] [get_bd_pins axi_interconnect_2/ARESETN] \
  [get_bd_pins axi_interconnect_3/ARESETN]
connect_bd_net [get_bd_pins clk_wiz_0/clk_out1] \
  [get_bd_pins v_tc_0/clk] [get_bd_pins v_axi4s_vid_out_0/vid_io_out_clk] [get_bd_pins HDMI_TX_0/PXLCLK_I]
connect_bd_net [get_bd_pins v_axi4s_vid_out_0/vtg_ce] [get_bd_pins v_tc_0/gen_clken]
connect_bd_net [get_bd_pins clk_wiz_0/clk_out2] [get_bd_pins HDMI_TX_0/PXLCLK_5X_I]
connect_bd_net -net ACLK_1 [get_bd_pins processing_system7_0/FCLK_CLK0] \
  [get_bd_pins processing_system7_0/M_AXI_GP0_ACLK] [get_bd_pins processing_system7_0/S_AXI_HP0_ACLK] \
  [get_bd_pins axi_interconnect_0/ACLK] [get_bd_pins axi_interconnect_0/S00_ACLK] [get_bd_pins axi_interconnect_0/M00_ACLK] \
  [get_bd_pins axi_vdma_0/s_axi_lite_aclk] [get_bd_pins axi_vdma_0/m_axis_mm2s_aclk] [get_bd_pins axi_vdma_0/m_axi_mm2s_aclk] \
  [get_bd_pins clk_wiz_0/clk_in1] [get_bd_pins v_vid_in_axi4s_0/aclk] [get_bd_pins v_axi4s_vid_out_0/aclk] \
  [get_bd_pins axi_interconnect_1/S01_ACLK] [get_bd_pins axi_interconnect_1/M00_ACLK] \
  [get_bd_pins axi_interconnect_1/S00_ACLK] [get_bd_pins axi_interconnect_1/ACLK] \
  [get_bd_pins proc_sys_reset_0/slowest_sync_clk] [get_bd_pins axis_subset_converter_0/aclk] \
  [get_bd_pins axi_vdma_1/s_axis_s2mm_aclk] [get_bd_pins axi_vdma_1/m_axi_s2mm_aclk] [get_bd_pins axi_vdma_1/s_axi_lite_aclk] \
  [get_bd_pins axi_interconnect_0/M01_ACLK] [get_bd_pins system_ila_0/clk] [get_bd_pins system_ila_1/clk] \
  [get_bd_pins system_ila_2/clk] [get_bd_pins system_ila_3/clk] [get_bd_pins v_vid_in_axi4s_1/aclk] \
  [get_bd_pins axis_subset_converter_1/aclk] [get_bd_pins axi_interconnect_2/M01_ACLK] \
  [get_bd_pins axi_interconnect_2/M00_ACLK] [get_bd_pins axi_interconnect_2/S00_ACLK] [get_bd_pins axi_interconnect_2/ACLK] \
  [get_bd_pins axi_interconnect_3/S01_ACLK] [get_bd_pins axi_interconnect_3/M00_ACLK] \
  [get_bd_pins axi_interconnect_3/S00_ACLK] [get_bd_pins axi_interconnect_3/ACLK] [get_bd_pins axi_vdma_3/s_axis_s2mm_aclk] \
  [get_bd_pins axi_vdma_3/m_axi_s2mm_aclk] [get_bd_pins axi_vdma_3/s_axi_lite_aclk] [get_bd_pins axi_vdma_2/m_axis_mm2s_aclk] \
  [get_bd_pins axi_vdma_2/m_axi_mm2s_aclk] [get_bd_pins axi_vdma_2/s_axi_lite_aclk] \
  [get_bd_pins processing_system7_0/M_AXI_GP1_ACLK] [get_bd_pins processing_system7_0/S_AXI_HP1_ACLK] \
  [get_bd_pins system_ila_4/clk] [get_bd_pins system_ila_5/clk] [get_bd_pins system_ila_6/clk]
connect_bd_net [get_bd_pins processing_system7_0/FCLK_RESET0_N] [get_bd_pins proc_sys_reset_0/ext_reset_in]
connect_bd_net [get_bd_pins v_axi4s_vid_out_0/vid_active_video] [get_bd_pins HDMI_TX_0/VGA_DE]
connect_bd_net -net v_axi4s_vid_out_0_vid_data [get_bd_pins v_axi4s_vid_out_0/vid_data] \
  [get_bd_pins HDMI_TX_0/VGA_RGB] [get_bd_pins system_ila_2/probe0]
connect_bd_net [get_bd_pins v_axi4s_vid_out_0/vid_hsync] [get_bd_pins HDMI_TX_0/VGA_HS]
connect_bd_net [get_bd_pins v_axi4s_vid_out_0/vid_vsync] [get_bd_pins HDMI_TX_0/VGA_VS]
connect_bd_net [get_bd_pins HDMI_TX_0/HDMI_CLK_P] [get_bd_ports HDMI_CLK_P_0]
connect_bd_net [get_bd_pins HDMI_TX_0/HDMI_CLK_N] [get_bd_ports HDMI_CLK_N_0]
connect_bd_net [get_bd_pins HDMI_TX_0/HDMI_D2_P] [get_bd_ports HDMI_D2_P_0]
connect_bd_net [get_bd_pins HDMI_TX_0/HDMI_D2_N] [get_bd_ports HDMI_D2_N_0]
connect_bd_net [get_bd_pins HDMI_TX_0/HDMI_D1_P] [get_bd_ports HDMI_D1_P_0]
connect_bd_net [get_bd_pins HDMI_TX_0/HDMI_D1_N] [get_bd_ports HDMI_D1_N_0]
connect_bd_net [get_bd_pins HDMI_TX_0/HDMI_D0_P] [get_bd_ports HDMI_D0_P_0]
connect_bd_net [get_bd_pins HDMI_TX_0/HDMI_D0_N] [get_bd_ports HDMI_D0_N_0]
connect_bd_net -net cmos_vsync_i_0_1 [get_bd_ports cmos_vsync_i_0] [get_bd_pins OV5640_Sensor_0/cmos_vsync_i]
connect_bd_net -net cmos_href_i_0_1 [get_bd_ports cmos_href_i_0] [get_bd_pins OV5640_Sensor_0/cmos_href_i]
connect_bd_net -net cmos_data_i_0_1 [get_bd_ports cmos_data_i_0] [get_bd_pins OV5640_Sensor_0/cmos_data_i]
connect_bd_net [get_bd_pins OV5640_Sensor_0/cmos_xclk_o] [get_bd_ports cmos_xclk_o_0]
connect_bd_net -net cmos_pclk_i_0_1 [get_bd_ports cmos_pclk_i_0] \
  [get_bd_pins OV5640_Sensor_0/cmos_pclk_i] [get_bd_pins v_vid_in_axi4s_0/vid_io_in_clk]
connect_bd_net [get_bd_pins util_vector_logic_1/Res] [get_bd_pins clk_wiz_0/reset]
connect_bd_net [get_bd_pins xlconstant_0/dout] [get_bd_pins axis_subset_converter_0/aresetn]
connect_bd_net [get_bd_pins axi_vdma_0/mm2s_introut] [get_bd_pins xlconcat_0/In0]
connect_bd_net [get_bd_pins axi_vdma_1/s2mm_introut] [get_bd_pins xlconcat_0/In1]
connect_bd_net -net xlconcat_0_dout [get_bd_pins xlconcat_0/dout] [get_bd_pins processing_system7_0/IRQ_F2P] [get_bd_pins system_ila_3/probe0]
connect_bd_net [get_bd_pins util_vector_logic_2/Res] [get_bd_pins xlconcat_0/In2]
connect_bd_net -net sw1_1 [get_bd_ports sw1] [get_bd_pins util_vector_logic_2/Op1]
connect_bd_net [get_bd_pins OV5640_Sensor_1/vid_clk_ce] [get_bd_pins v_vid_in_axi4s_1/vid_io_in_ce]
connect_bd_net -net OV5640_Sensor_1_rgb_o [get_bd_pins OV5640_Sensor_1/rgb_o] \
  [get_bd_pins v_vid_in_axi4s_1/vid_data] [get_bd_pins system_ila_4/probe0]
connect_bd_net [get_bd_pins OV5640_Sensor_1/vs_o] [get_bd_pins v_vid_in_axi4s_1/vid_vsync]
connect_bd_net [get_bd_pins OV5640_Sensor_1/hs_o] [get_bd_pins v_vid_in_axi4s_1/vid_hsync] [get_bd_pins v_vid_in_axi4s_1/vid_active_video]
connect_bd_net -net cmos_pclk_i_1_1 [get_bd_ports cmos_pclk_i_1] \
  [get_bd_pins OV5640_Sensor_1/cmos_pclk_i] [get_bd_pins v_vid_in_axi4s_1/vid_io_in_clk]
connect_bd_net [get_bd_pins xlconstant_1/dout] [get_bd_pins axis_subset_converter_1/aresetn]
connect_bd_net [get_bd_pins axi_vdma_3/s2mm_introut] [get_bd_pins xlconcat_0/In3]
connect_bd_net [get_bd_pins axi_vdma_2/mm2s_introut] [get_bd_pins xlconcat_0/In4]
connect_bd_net -net cmos_vsync_i_1_1 [get_bd_ports cmos_vsync_i_1] [get_bd_pins OV5640_Sensor_1/cmos_vsync_i]
connect_bd_net -net cmos_href_i_1_1 [get_bd_ports cmos_href_i_1] [get_bd_pins OV5640_Sensor_1/cmos_href_i]
connect_bd_net -net cmos_data_i_1_1 [get_bd_ports cmos_data_i_1] [get_bd_pins OV5640_Sensor_1/cmos_data_i]
connect_bd_net [get_bd_pins OV5640_Sensor_1/cmos_xclk_o] [get_bd_ports cmos_xclk_o_1]
connect_bd_net -net processing_system7_0_FCLK_CLK1 [get_bd_pins processing_system7_0/FCLK_CLK1] \
  [get_bd_pins OV5640_Sensor_0/clk_i] [get_bd_pins system_ila_5/probe0]
connect_bd_net -net processing_system7_0_FCLK_CLK2 [get_bd_pins processing_system7_0/FCLK_CLK2] \
  [get_bd_pins OV5640_Sensor_1/clk_i] [get_bd_pins system_ila_6/probe0]
set_property HDL_ATTRIBUTE.DEBUG true [get_bd_intf_nets v_vid_in_axi4s_1_video_out]
set_property HDL_ATTRIBUTE.MARK_DEBUG true [get_bd_intf_nets v_vid_in_axi4s_1_video_out]
set_property HDL_ATTRIBUTE.DEBUG true [get_bd_intf_nets axi_vdma_3_M_AXI_S2MM]
set_property HDL_ATTRIBUTE.MARK_DEBUG true [get_bd_intf_nets axi_vdma_3_M_AXI_S2MM]
set_property HDL_ATTRIBUTE.DEBUG true [get_bd_intf_nets axi_interconnect_2_M00_AXI]
set_property HDL_ATTRIBUTE.MARK_DEBUG true [get_bd_intf_nets axi_interconnect_2_M00_AXI]
set_property HDL_ATTRIBUTE.DEBUG true [get_bd_intf_nets v_vid_in_axi4s_0_video_out]
set_property HDL_ATTRIBUTE.MARK_DEBUG true [get_bd_intf_nets v_vid_in_axi4s_0_video_out]
set_property HDL_ATTRIBUTE.DEBUG true [get_bd_intf_nets axi_vdma_2_M_AXI_MM2S]
set_property HDL_ATTRIBUTE.MARK_DEBUG true [get_bd_intf_nets axi_vdma_2_M_AXI_MM2S]
set_property HDL_ATTRIBUTE.DEBUG true [get_bd_intf_nets axi_vdma_1_M_AXI_S2MM]
set_property HDL_ATTRIBUTE.MARK_DEBUG true [get_bd_intf_nets axi_vdma_1_M_AXI_S2MM]
set_property HDL_ATTRIBUTE.DEBUG true [get_bd_intf_nets axi_vdma_0_M_AXI_MM2S]
set_property HDL_ATTRIBUTE.MARK_DEBUG true [get_bd_intf_nets axi_vdma_0_M_AXI_MM2S]
set_property HDL_ATTRIBUTE.DEBUG true [get_bd_intf_nets axis_subset_converter_1_M_AXIS]
set_property HDL_ATTRIBUTE.MARK_DEBUG true [get_bd_intf_nets axis_subset_converter_1_M_AXIS]
set_property HDL_ATTRIBUTE.DEBUG true [get_bd_intf_nets axi_interconnect_2_M01_AXI]
set_property HDL_ATTRIBUTE.MARK_DEBUG true [get_bd_intf_nets axi_interconnect_2_M01_AXI]
set_property HDL_ATTRIBUTE.DEBUG true [get_bd_intf_nets axi_interconnect_3_M00_AXI]
set_property HDL_ATTRIBUTE.MARK_DEBUG true [get_bd_intf_nets axi_interconnect_3_M00_AXI]
set_property HDL_ATTRIBUTE.DEBUG true [get_bd_intf_nets axi_interconnect_0_M00_AXI]
set_property HDL_ATTRIBUTE.MARK_DEBUG true [get_bd_intf_nets axi_interconnect_0_M00_AXI]
set_property HDL_ATTRIBUTE.DEBUG true [get_bd_intf_nets axis_subset_converter_0_M_AXIS]
set_property HDL_ATTRIBUTE.MARK_DEBUG true [get_bd_intf_nets axis_subset_converter_0_M_AXIS]
set_property HDL_ATTRIBUTE.DEBUG true [get_bd_intf_nets axi_interconnect_0_M01_AXI]
set_property HDL_ATTRIBUTE.MARK_DEBUG true [get_bd_intf_nets axi_interconnect_0_M01_AXI]
set_property HDL_ATTRIBUTE.DEBUG true [get_bd_intf_nets axi_vdma_0_M_AXIS_MM2S]
set_property HDL_ATTRIBUTE.MARK_DEBUG true [get_bd_intf_nets axi_vdma_0_M_AXIS_MM2S]
set_property HDL_ATTRIBUTE.DEBUG true [get_bd_intf_nets axi_interconnect_1_M00_AXI]
set_property HDL_ATTRIBUTE.MARK_DEBUG true [get_bd_intf_nets axi_interconnect_1_M00_AXI]
set_property HDL_ATTRIBUTE.DEBUG true [get_bd_nets OV5640_Sensor_0_rgb_o]
set_property HDL_ATTRIBUTE.MARK_DEBUG true [get_bd_nets OV5640_Sensor_0_rgb_o]
set_property HDL_ATTRIBUTE.DEBUG true [get_bd_nets v_axi4s_vid_out_0_vid_data]
set_property HDL_ATTRIBUTE.MARK_DEBUG true [get_bd_nets v_axi4s_vid_out_0_vid_data]
set_property HDL_ATTRIBUTE.DEBUG true [get_bd_nets xlconcat_0_dout]
set_property HDL_ATTRIBUTE.MARK_DEBUG true [get_bd_nets xlconcat_0_dout]
set_property HDL_ATTRIBUTE.DEBUG true [get_bd_nets OV5640_Sensor_1_rgb_o]
set_property HDL_ATTRIBUTE.MARK_DEBUG true [get_bd_nets OV5640_Sensor_1_rgb_o]
set_property HDL_ATTRIBUTE.DEBUG true [get_bd_nets processing_system7_0_FCLK_CLK1]
set_property HDL_ATTRIBUTE.MARK_DEBUG true [get_bd_nets processing_system7_0_FCLK_CLK1]
set_property HDL_ATTRIBUTE.DEBUG true [get_bd_nets processing_system7_0_FCLK_CLK2]
set_property HDL_ATTRIBUTE.MARK_DEBUG true [get_bd_nets processing_system7_0_FCLK_CLK2]

# ---- address map ----
assign_bd_address -offset 0x00000000 -range 1G -target_address_space [get_bd_addr_spaces axi_vdma_0/Data_MM2S] [get_bd_addr_segs processing_system7_0/S_AXI_HP0/HP0_DDR_LOWOCM]
assign_bd_address -offset 0x00000000 -range 1G -target_address_space [get_bd_addr_spaces axi_vdma_1/Data_S2MM] [get_bd_addr_segs processing_system7_0/S_AXI_HP0/HP0_DDR_LOWOCM]
assign_bd_address -offset 0x00000000 -range 1G -target_address_space [get_bd_addr_spaces axi_vdma_2/Data_MM2S] [get_bd_addr_segs processing_system7_0/S_AXI_HP1/HP1_DDR_LOWOCM]
assign_bd_address -offset 0x00000000 -range 1G -target_address_space [get_bd_addr_spaces axi_vdma_3/Data_S2MM] [get_bd_addr_segs processing_system7_0/S_AXI_HP1/HP1_DDR_LOWOCM]
assign_bd_address -offset 0x43000000 -range 64K -target_address_space [get_bd_addr_spaces processing_system7_0/Data] [get_bd_addr_segs axi_vdma_0/S_AXI_LITE/Reg]
assign_bd_address -offset 0x43010000 -range 64K -target_address_space [get_bd_addr_spaces processing_system7_0/Data] [get_bd_addr_segs axi_vdma_1/S_AXI_LITE/Reg]
assign_bd_address -offset 0x83000000 -range 64K -target_address_space [get_bd_addr_spaces processing_system7_0/Data] [get_bd_addr_segs axi_vdma_2/S_AXI_LITE/Reg]
assign_bd_address -offset 0x83010000 -range 64K -target_address_space [get_bd_addr_spaces processing_system7_0/Data] [get_bd_addr_segs axi_vdma_3/S_AXI_LITE/Reg]

validate_bd_design
save_bd_design
